# Altium schematic sheet SoundFilter.SchDoc
size 311 x 223 mm
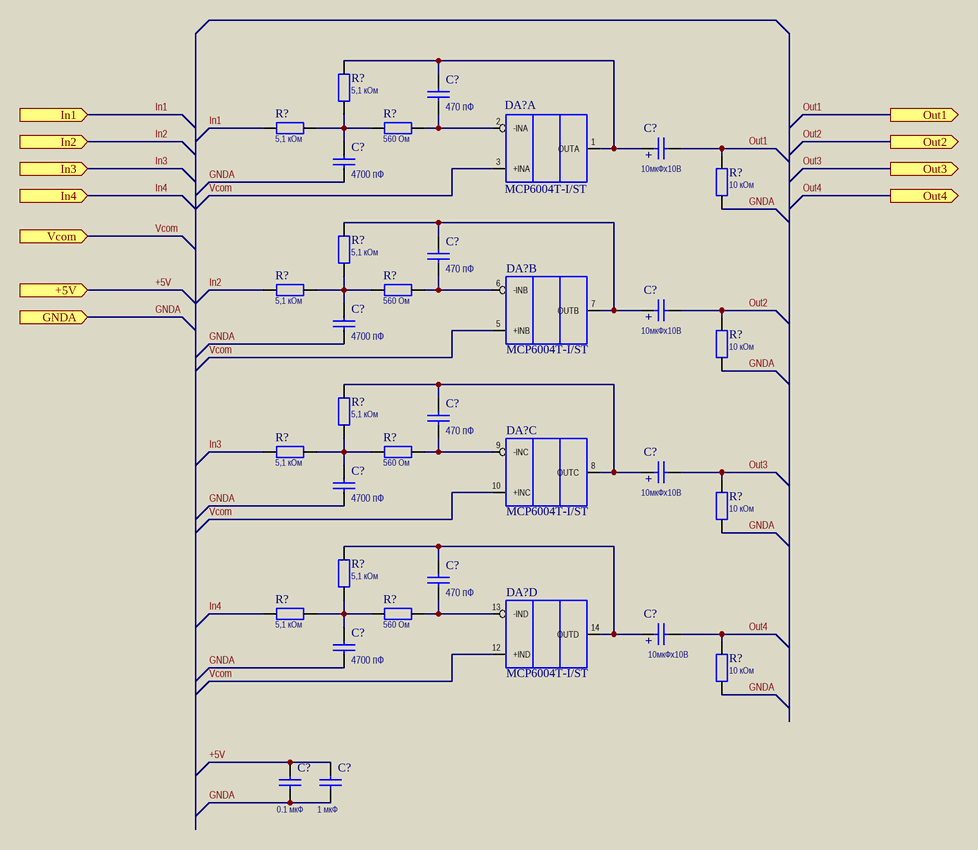
[diagram p0: SoundFilter.SchDoc]

## Parts
(Parts that share a designator on the sheet are numbered #1, #2 ... from top to bottom, then left to right.)
C?#1  470 пФ  [Chip0603]
C?#2  4700 пФ  [Chip0603]
C?#3  value 10мкФx10В  [ChipA]  (hidden comment: CP)
C?#4  470 пФ  [Chip0603]
C?#5  4700 пФ  [Chip0603]
C?#6  value 10мкФx10В  [ChipA]  (hidden comment: CP)
C?#7  470 пФ  [Chip0603]
C?#8  4700 пФ  [Chip0603]
C?#9  value 10мкФx10В  [ChipA]  (hidden comment: CP)
C?#10  470 пФ  [Chip0603]
C?#11  4700 пФ  [Chip0603]
C?#12  value 10мкФx10В  [ChipA]  (hidden comment: CP)
C?#13  value 0.1 мкФ  [Chip0603]  (hidden comment: C)
C?#14  value 1 мкФ  [Chip0603]  (hidden comment: C)
DA?#1  MCP6004T-I/ST  [TSSOP14]  (part A of 4)
DA?#2  MCP6004T-I/ST  [TSSOP14]  (part B of 4)
DA?#3  MCP6004T-I/ST  [TSSOP14]  (part C of 4)
DA?#4  MCP6004T-I/ST  [TSSOP14]  (part D of 4)
R?#1  5,1 кОм  [Res0603]
R?#2  5,1 кОм  [Res0603]
R?#3  560 Ом  [Res0603]
R?#4  10 кОм  [Res0603]
R?#5  5,1 кОм  [Res0603]
R?#6  5,1 кОм  [Res0603]
R?#7  560 Ом  [Res0603]
R?#8  10 кОм  [Res0603]
R?#9  5,1 кОм  [Res0603]
R?#10  5,1 кОм  [Res0603]
R?#11  560 Ом  [Res0603]
R?#12  10 кОм  [Res0603]
R?#13  5,1 кОм  [Res0603]
R?#14  5,1 кОм  [Res0603]
R?#15  560 Ом  [Res0603]
R?#16  10 кОм  [Res0603]

## Ports
+5V (in), GNDA (in), In1 (in), In2 (in), In3 (in), In4 (in), Out1 (out), Out2 (out), Out3 (out), Out4 (out), Vcom (in)

## Nets
+5V: C?#13.1 C?#14.1 DA?#1.4(Vcc) ; port +5V
GNDA: C?#2.2 C?#5.2 C?#8.2 C?#11.2 C?#13.2 C?#14.2 DA?#1.11(Vss) R?#4.2 R?#8.2 R?#12.2 R?#16.2 ; port GNDA
In1: R?#2.2 ; port In1
In2: R?#6.2 ; port In2
In3: R?#10.2 ; port In3
In4: R?#14.2 ; port In4
Out1: C?#3.2 R?#4.1 ; port Out1
Out2: C?#6.2 R?#8.1 ; port Out2
Out3: C?#9.2 R?#12.1 ; port Out3
Out4: C?#12.2 R?#16.1 ; port Out4
Vcom: DA?#1.3(+INA) DA?#2.5(+INB) DA?#3.10(+INC) DA?#4.12(+IND) ; port Vcom
NetC?#1_1: C?#1.1 C?#3.1 DA?#1.1(OUTA) R?#1.1
NetC?#1_2: C?#1.2 DA?#1.2(-INA) R?#3.1
NetC?#2_1: C?#2.1 R?#1.2 R?#2.1 R?#3.2
NetC?#4_1: C?#4.1 C?#6.1 DA?#2.7(OUTB) R?#5.1
NetC?#4_2: C?#4.2 DA?#2.6(-INB) R?#7.1
NetC?#5_1: C?#5.1 R?#5.2 R?#6.1 R?#7.2
NetC?#7_1: C?#7.1 C?#9.1 DA?#3.8(OUTC) R?#9.1
NetC?#7_2: C?#7.2 DA?#3.9(-INC) R?#11.1
NetC?#8_1: C?#8.1 R?#9.2 R?#10.1 R?#11.2
NetC?#10_1: C?#10.1 C?#12.1 DA?#4.14(OUTD) R?#13.1
NetC?#10_2: C?#10.2 DA?#4.13(-IND) R?#15.1
NetC?#11_1: C?#11.1 R?#13.2 R?#14.1 R?#15.2

## Notes on the sheet
- Перв. примен.
- М. экспертиза
- Справ. №
- Подп. и дата
- Инв. № дубл.
- Взам. инв. №
- Изм.
- Разраб.
- Лист.
- № докум.
- Подп.
- Дата
- Лит.
- Масса
- Масш.
- Инв. № подп.
- Пров.
- Т. контр.
- Н. контр.
- Утв.
- Схема электрическая
- принципиальная
- Лист
- Листов
- Копировал
- Формат А2
- (in symbol CP) +

## Library data of the parts
C?#1 C?#2 C?#4 C?#5 C?#7 C?#8 C?#10 C?#11 C?#13 C?#14 = C: Manufacturer: Any; SubClass: General Purpose; Class: Capacitors; Author: Harry E. Zhurov
  C?#1 C?#4 C?#7 C?#10: Value: 470 пФ
  C?#2 C?#5 C?#8 C?#11: Value: 4700 пФ
C?#3 C?#6 C?#9 C?#12 = CP: Manufacturer: Any; Class: Capacitors; SubClass: Polar; Name: TPSA106K010R0900; Author: Harry E. Zhurov
DA?#1-DA?#4 = MCP6004T-I/ST: AnnotateMatch: 1; Name: MCP6004T-I/ST
R?#1-R?#16 = R: Manufacturer: Any; Class: Resistor; SubClass: Constant
  R?#1 R?#2 R?#5 R?#6 R?#9 R?#10 R?#13 R?#14: Value: 5,1 кОм
  R?#3 R?#7 R?#11 R?#15: Value: 560 Ом
  R?#4 R?#8 R?#12 R?#16: Value: 10 кОм